# Altium schematic sheet DS3231_ClockLed.SchDoc
size A4; SheetNumber: 7; SheetTotal: 8
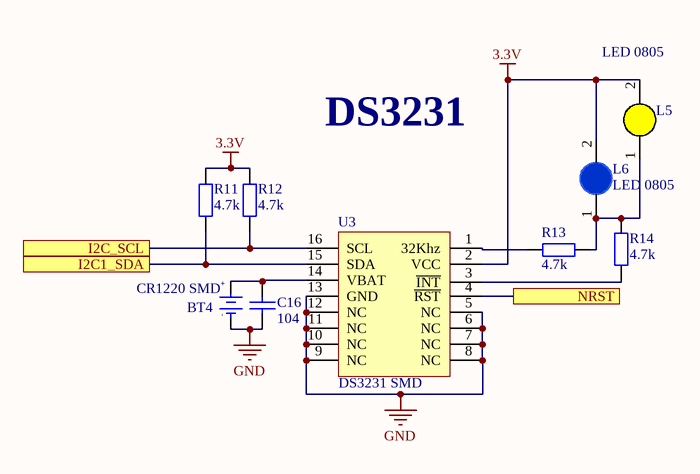
[diagram p0: DS3231_ClockLed.SchDoc]

## Parts
BT4  CR1220 SMD  [DE PIN CR1220]
C16  104  [tu 0805]
L5  LED 0805  [LED-1206-Yellow]
L6  LED 0805  [LED-0805-Blue]
R11  4.7k  [tro smd 0805]
R12  4.7k  [tro smd 0805]
R13  4.7k  [tro smd 0805]
R14  4.7k  [tro smd 0805]
U3  DS3231 SMD  [SOIC 16]

## Ports
I2C1_SDA, I2C_SCL, NRST

## Nets
3.3V: L5.2(K) L6.2(K) R11.2 R12.2 U3.2(VCC)
GND: BT4.2(GND) C16.2 U3.5(NC) U3.6(NC) U3.7(NC) U3.8(NC) U3.9(NC) U3.10(NC) U3.11(NC) U3.12(NC) U3.13(GND)
I2C1_SDA: R11.1 U3.15(SDA) ; port I2C1_SDA
I2C_SCL: R12.1 U3.16(SCL) ; port I2C_SCL
NRST: U3.4(~{RST}) ; port NRST
NetBT4_1: BT4.1(+3V) C16.1 U3.14(VBAT)
NetL5_1: L5.1(A) L6.1(A) R13.1 R14.1
NetR13_2: R13.2 U3.1(32Khz)
NetR14_2: R14.2 U3.3(~{INT})

## Notes on the sheet
- DS3231
- (in symbol De pin CR1220 SMD) +; -

## Library data of the parts
BT4 = De pin CR1220 SMD: Ten: Đế PIN CR1220 SMD; Ma_Hang: MH000833
C16 = Tu 0805 104 50V 10%: Dán; Don_Vi: Con; So_Chan: 2; Ten_Linh_Kien: Tụ 0805 104-100nF 10% 50V; Ma_Hang: MH004551; Chung_Loai: Dán; Kieu_Chan: *
L5 = LED 1206 Vang: Dán; Don_Vi: Con; Ma_Hang: MH002331; Ten_Linh_Kien: LED1206 Màu Vàng (Yellow); Ghi_Chu: *; Kieu_Chan: *; Chung_Loai: Dán
L6 = LED 0805 Xanh Duong: Dán; Don_Vi: Con; Ma_Hang: MH002327; Ten_Linh_Kien: LED 0805 Màu Xanh Dương (Blue); Ghi_Chu: *; Kieu_Chan: *; Chung_Loai: Dán
R11-R14 = Tro 0805 5% 4.7k: Dán; Don_Vi: Con; So_Chan: 2; Ten_Linh_Kien: Trở 0805 5% 4.7k; Ma_Hang: MH005307; Chung_Loai: Dán; Kieu_Chan: *
U3 = DS3231 SMD: SOIC